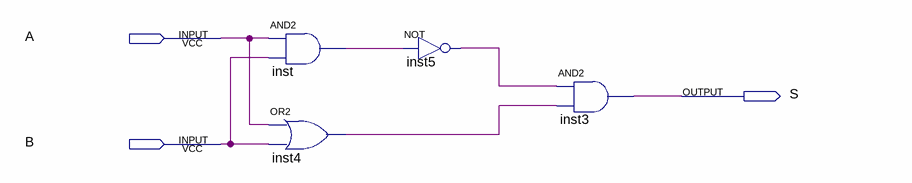
[diagram p0: schematic sheet]
// Quartus schematic xor_nda1_3.bdf as structural Verilog: 4 symbols, 3 pins
module xor_nda1_3 (
  input  A,
  input  B,
  output S
);

  wire inst4_out, inst5_out, inst_out;

  and inst (inst_out, A, B);
  or inst4 (inst4_out, A, B);
  not inst5 (inst5_out, inst_out);
  and inst3 (S, inst5_out, inst4_out);
endmodule
